# Altium schematic sheet VUE_PIC32_v1_0_USB-Serial.SchDoc: [VUE32 - USB-Serial]
size A4; Engineer: JFDuval; Revision: 1.0
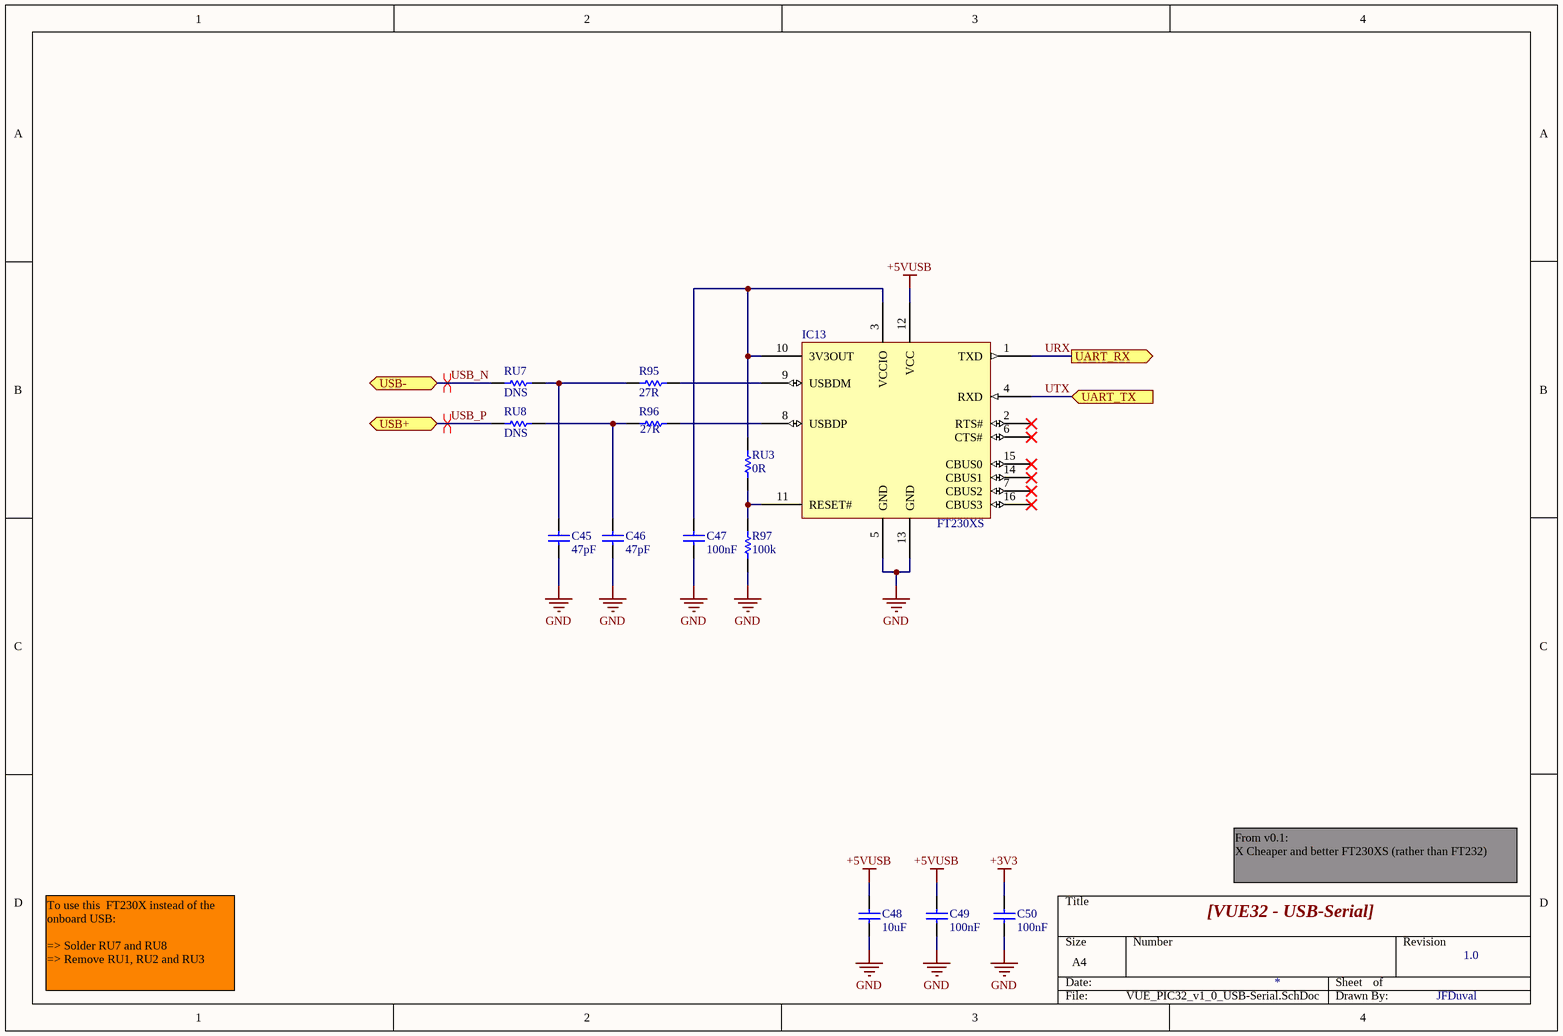
[diagram p0: VUE_PIC32_v1_0_USB-Serial.SchDoc]

## Parts
C45  47pF  [0402C]
C46  47pF  [0402C]
C47  100nF  [0402C]
C48  10uF  [0805C]
C49  100nF  [0402C]
C50  100nF  [0402C]
IC13  FT230XS  [SSOP16]
R95  27R  [0402]
R96  27R  [0402]
R97  100k  [0402]
RU3  0R  [0402]
RU7  DNS  [0603]
RU8  DNS  [0603]

## Ports
UART_RX (out), UART_TX (in), USB+ (bidir), USB- (bidir)

## Nets
+3V3: C50.2
+5VUSB: C48.2 C49.2 IC13.12(VCC)
GND: C45.1 C46.1 C47.1 C48.1 C49.1 C50.1 IC13.5(GND) IC13.13(GND) R97.1
URX: IC13.1(TXD) ; port UART_RX
USB_N: RU7.1 ; port USB-
USB_P: RU8.1 ; port USB+
UTX: IC13.4(RXD) ; port UART_TX
NetC45_2: C45.2 R95.1 RU7.2
NetC46_2: C46.2 R96.1 RU8.2
NetC47_2: C47.2 IC13.3(VCCIO) IC13.10(3V3OUT) RU3.1
NetIC13_8: IC13.8(USBDP) R96.2
NetIC13_9: IC13.9(USBDM) R95.2
NetIC13_11: IC13.11(RESET#) R97.2 RU3.2

Not connected (* = marked no-connect by the designer): IC13 2(RTS#)* 6(CTS#)* 7(CBUS2)* 14(CBUS1)* 15(CBUS0)* 16(CBUS3)*

## Layout directives
differential pair: USB_N, USB_P

## Notes on the sheet
- From v0.1:
  X Cheaper and better FT230XS (rather than FT232)
- To use this  FT230X instead of the onboard USB:
  => Solder RU7 and RU8
  => Remove RU1, RU2 and RU3

## Library data of the parts
C45 C46 = CAP_TDK_C_0402_47pF_50V: CAP CER 47PF 50V 5% NP0 0402; MfgPartNumber: CGA2B2C0G1H470J; Mfg: TDK; Digikey: 445-5592-1-ND; Value: 47pF
C47 C49 C50 = CAP_TDK_C_0402_100nF_25V: CAP CER 0.1UF 25V Y5V 0402; MfgPartNumber: C1005Y5V1E104Z; Mfg: TDK; Value: 100nF; Digikey: 445-3445-1-ND
C48 = CAP_MURATA_C_0805_10uF_16V: CAP CER 10UF 16V Y5V 0805; MfgPartNumber: GRM21BF51C106ZE15L; Mfg: Murata; Digikey: 490-3347-1-ND; Value: 10uF
IC13 = IC_FTDI_FT230XS_USB_UART_SSOP16: IC USB ERIAL BASIC UART SSOP-16; Mfg: FTDI; MfgPartNumber: FT230XS; Value: FT230XS; Digikey: 768-1135-1-ND
R95 R96 = RES_PANASONIC_0402_27R_1PCT: RES 27.0 OHM 1/10W 1% 0402 SMD; MfgPartNumber: ERJ-2RKF27R0X; Mfg: Panasonic; Digikey: P27.0LCT-ND; Value: 27R
R97 = RES_YAGEO_0402_100K_1PCT: RES 100K OHM 1/16W 1% 0402 SMD; MfgPartNumber: RC0402FR-07100KL; Mfg: Yageo; Digikey: 311-100KLRCT-ND; Value: 100k
RU3 = RES_YAGEO_0402_0R_1PCT: RES 0.0 OHM 1/16W 0402 SMD; MfgPartNumber: RC0402JR-070RL; Mfg: Yageo; Digikey: 311-0.0JRCT-ND; Value: 0R
RU7 RU8 = RES_DO_NOT_SOLDER_DNS_0603: Optional jumper - Do Not Solder; Mfg: NULL; MfgPartNumber: NULL; Digikey: NULL; Value: DNS